# Altium schematic sheet _power.SchDoc
size Tabloid
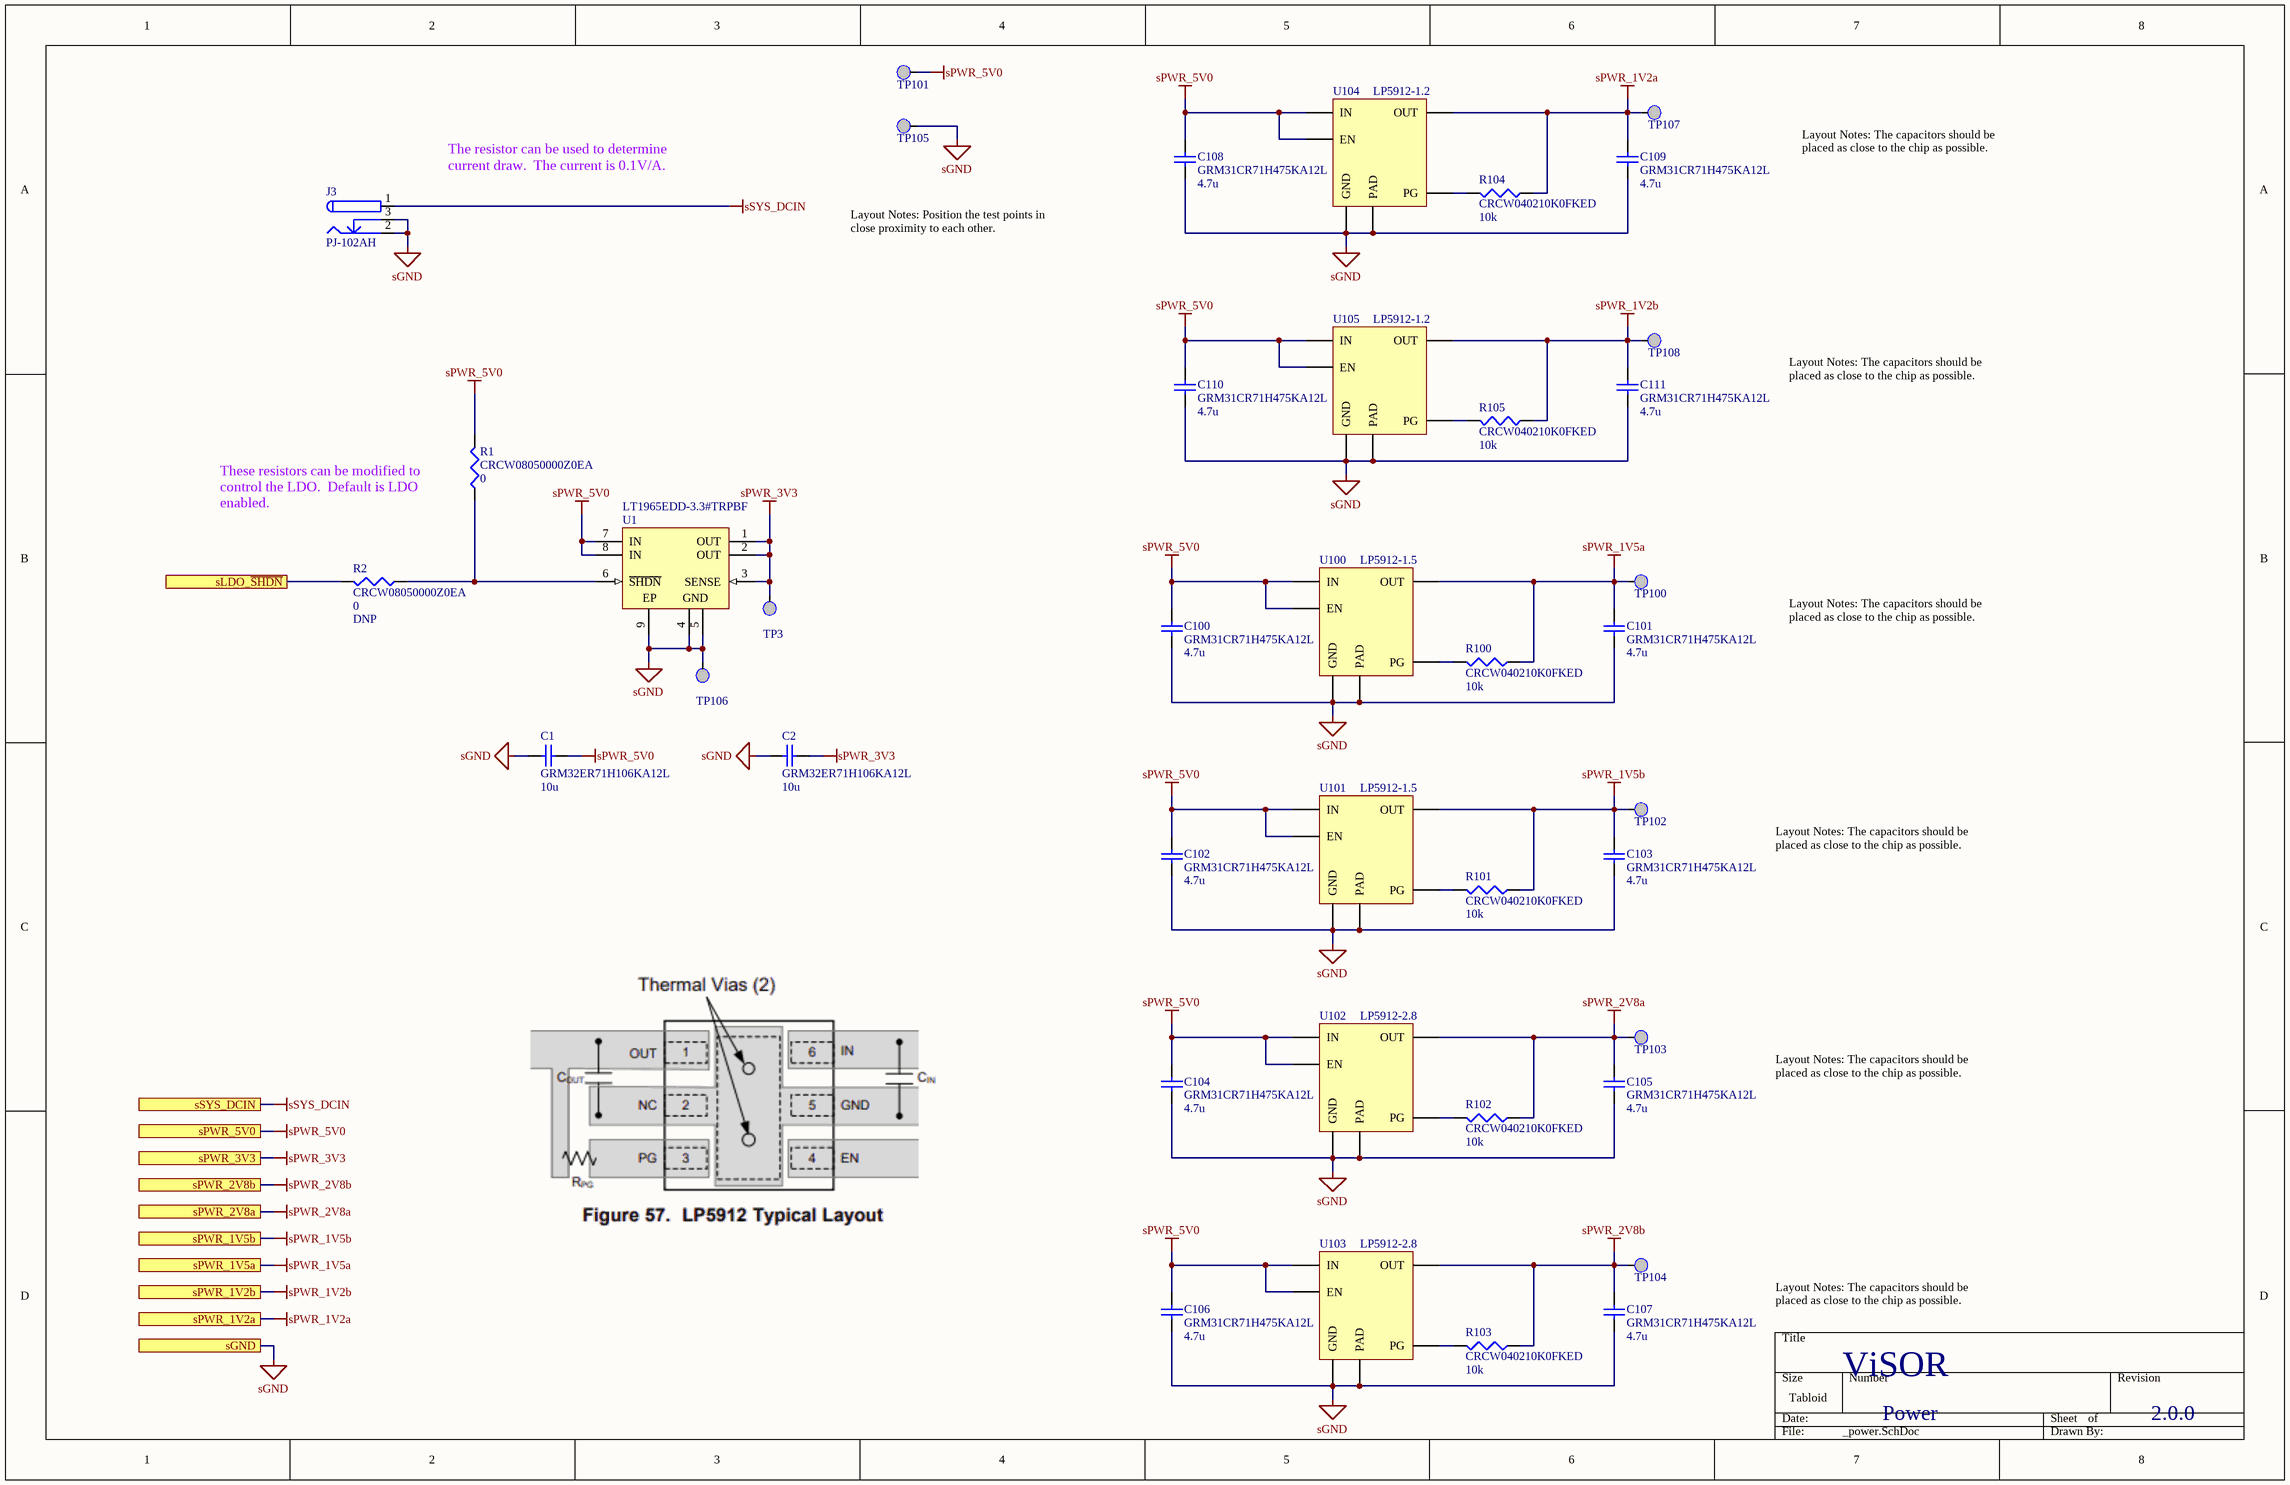
[diagram p0: _power.SchDoc]

## Parts
C1  GRM32ER71H106KA12L  value 10u  [1210]
C2  GRM32ER71H106KA12L  value 10u  [1210]
C100  GRM31CR71H475KA12L  value 4.7u  [1206]
C101  GRM31CR71H475KA12L  value 4.7u  [1206]
C102  GRM31CR71H475KA12L  value 4.7u  [1206]
C103  GRM31CR71H475KA12L  value 4.7u  [1206]
C104  GRM31CR71H475KA12L  value 4.7u  [1206]
C105  GRM31CR71H475KA12L  value 4.7u  [1206]
C106  GRM31CR71H475KA12L  value 4.7u  [1206]
C107  GRM31CR71H475KA12L  value 4.7u  [1206]
C108  GRM31CR71H475KA12L  value 4.7u  [1206]
C109  GRM31CR71H475KA12L  value 4.7u  [1206]
C110  GRM31CR71H475KA12L  value 4.7u  [1206]
C111  GRM31CR71H475KA12L  value 4.7u  [1206]
J3  PJ-102AH  [PJ-102AH]
R1  CRCW08050000Z0EA  value 0  [6-0805_M]
R2  CRCW08050000Z0EA  value 0  [6-0805_M]
R100  CRCW040210K0FKED  value 10k  [0402]
R101  CRCW040210K0FKED  value 10k  [0402]
R102  CRCW040210K0FKED  value 10k  [0402]
R103  CRCW040210K0FKED  value 10k  [0402]
R104  CRCW040210K0FKED  value 10k  [0402]
R105  CRCW040210K0FKED  value 10k  [0402]
TP3  TP  [TP_TH]  (value not drawn)
TP100  TP  [TP_TH]  (value not drawn)
TP101  TP  [TP_TH]  (value not drawn)
TP102  TP  [TP_TH]  (value not drawn)
TP103  TP  [TP_TH]  (value not drawn)
TP104  TP  [TP_TH]  (value not drawn)
TP105  TP  [TP_TH]  (value not drawn)
TP106  TP  [TP_TH]  (value not drawn)
TP107  TP  [TP_TH]  (value not drawn)
TP108  TP  [TP_TH]  (value not drawn)
U1  LT1965EDD-3.3#TRPBF  [LT-DD-8_V - MOD]
U100  LP5912-1.5  [DRV0006A]
U101  LP5912-1.5  [DRV0006A]
U102  LP5912-2.8  [DRV0006A]
U103  LP5912-2.8  [DRV0006A]
U104  LP5912-1.2  [DRV0006A]
U105  LP5912-1.2  [DRV0006A]

## Ports
sGND, sLDO_~{SHDN}, sPWR_1V2a, sPWR_1V2b, sPWR_1V5a, sPWR_1V5b, sPWR_2V8a, sPWR_2V8b, sPWR_3V3, sPWR_5V0, sSYS_DCIN

## Nets
sGND: C1.1 C2.1 C100.1 C101.1 C102.1 C103.1 C104.1 C105.1 C106.1 C107.1 C108.1 C109.1 C110.1 C111.1 J3.2 J3.3 TP105.1 TP106.1 U1.4(GND) U1.5(GND) U1.9(EP) U100.5(GND) U100.7(PAD) U101.5(GND) U101.7(PAD) U102.5(GND) U102.7(PAD) U103.5(GND) U103.7(PAD) U104.5(GND) U104.7(PAD) U105.5(GND) U105.7(PAD) ; port sGND
sPWR_1V2a: C109.2 R104.1 TP107.1 U104.1(OUT) ; port sPWR_1V2a
sPWR_1V2b: C111.2 R105.1 TP108.1 U105.1(OUT) ; port sPWR_1V2b
sPWR_1V5a: C101.2 R100.1 TP100.1 U100.1(OUT) ; port sPWR_1V5a
sPWR_1V5b: C103.2 R101.1 TP102.1 U101.1(OUT) ; port sPWR_1V5b
sPWR_2V8a: C105.2 R102.1 TP103.1 U102.1(OUT) ; port sPWR_2V8a
sPWR_2V8b: C107.2 R103.1 TP104.1 U103.1(OUT) ; port sPWR_2V8b
sPWR_3V3: C2.2 TP3.1 U1.1(OUT) U1.2(OUT) U1.3(SENSE) ; port sPWR_3V3
sPWR_5V0: C1.2 C100.2 C102.2 C104.2 C106.2 C108.2 C110.2 R1.2 TP101.1 U1.7(IN) U1.8(IN) U100.4(EN) U100.6(IN) U101.4(EN) U101.6(IN) U102.4(EN) U102.6(IN) U103.4(EN) U103.6(IN) U104.4(EN) U104.6(IN) U105.4(EN) U105.6(IN) ; port sPWR_5V0
sSYS_DCIN: J3.1 ; port sSYS_DCIN
sLDO_~{SHDN}: R2.2 ; port sLDO_~{SHDN}
NetR1_1: R1.1 R2.1 U1.6(~{SHDN})
NetR100_2: R100.2 U100.3(PG)
NetR101_2: R101.2 U101.3(PG)
NetR102_2: R102.2 U102.3(PG)
NetR103_2: R103.2 U103.3(PG)
NetR104_2: R104.2 U104.3(PG)
NetR105_2: R105.2 U105.3(PG)

## Notes on the sheet
- Layout Notes: The capacitors should be placed as close to the chip as possible.
- The resistor can be used to determine current draw.  The current is 0.1V/A.
- Layout Notes: Position the test points in close proximity to each other.
- (near R1) These resistors can be modified to control the LDO.  Default is LDO enabled.
- ViSOR
- Power
- 2.0.0
- (in symbol Res3) DNP

## Library data of the parts
C1 C2 = GRM32ER71HxxxKdddd: -55-125C, 1005, 50V, X7R, ±10%
C100-C111 = GRM31CR71HxxxKdddd: -55-125C, 3216, 50V, X7R, ±10%
J3 = PJ-102AH: Low Voltage Power Supply Connector, 2.1 mm; Supplier 1: Mouser; Supplier Part Number 1: 490-PJ-102AH
R1 R2 = Res3: 0Ω Resistor; Published: 8-Jun-2000; LatestRevisionDate: 29-May-2009; LatestRevisionNote: IPC-7351 Footprint Added.; PackageReference: J1-0603; Publisher: Altium Limited; PackageDescription: Chip Resistor
R100-R105 = CRCW0402xxxxFKED: 0.125W, -55-155C, 1005, 50V, ±1%
U1 = LT1965EDD-3.3#TRPBF: 1.1 A, Low Noise, Low Dropout Linear Regulator, 1.8 to 20 V Vin, 3.3 V Vout, 8-pin SON (DD-8), -40 to 125 degC, Pb-Free, Tape and Reel; Manufacturer: Linear Technology; Discrete Pass Element: no; Dropout Voltage(V): 0.31; Iout(mA): 1100; Isupply(mA): 0.5; Noise(uV): 40; Number of Outputs: 1; Output Voltage: 3.3 V; PSRR(dB): 75; Vin Max(V): 20; Vin Min(V): 1.8; DatasheetVersion: Rev. A; PackageVersion: Jun-10; PackageReference: DD-8; PackageDescription: 8-Pin Plastic DFN, Body 3 x 3 mm, Pitch 0.5 mm; Supplier 1: Digi-Key; Supplier Part Number 1: LT1965EDD-3.3#TRPBF-ND; Packing: Tape and Reel; RoHS: TRUE; Shutdown Current(uA): 1; Mounting Technology: Surface Mount; Code_JEDEC: MO-229; PartNumber: LT1965EDD-3.3#TRPBF; ComponentLink1Description: Manufacturer URL; ComponentLink1URL: http://www.linear.com/; ComponentLink2Description: Datasheet; ComponentLink2URL: http://cds.linear.com/docs/en/datasheet/1965fa.pdf; ComponentLink3Description: Package Specification; ComponentLink3URL: http://cds.linear.com/docs/en/packaging/DFN_8_05-08-1698.pdf
U100-U105 = LP5912-x.x: 500-mA Low-Noise, Low-IQ LDO